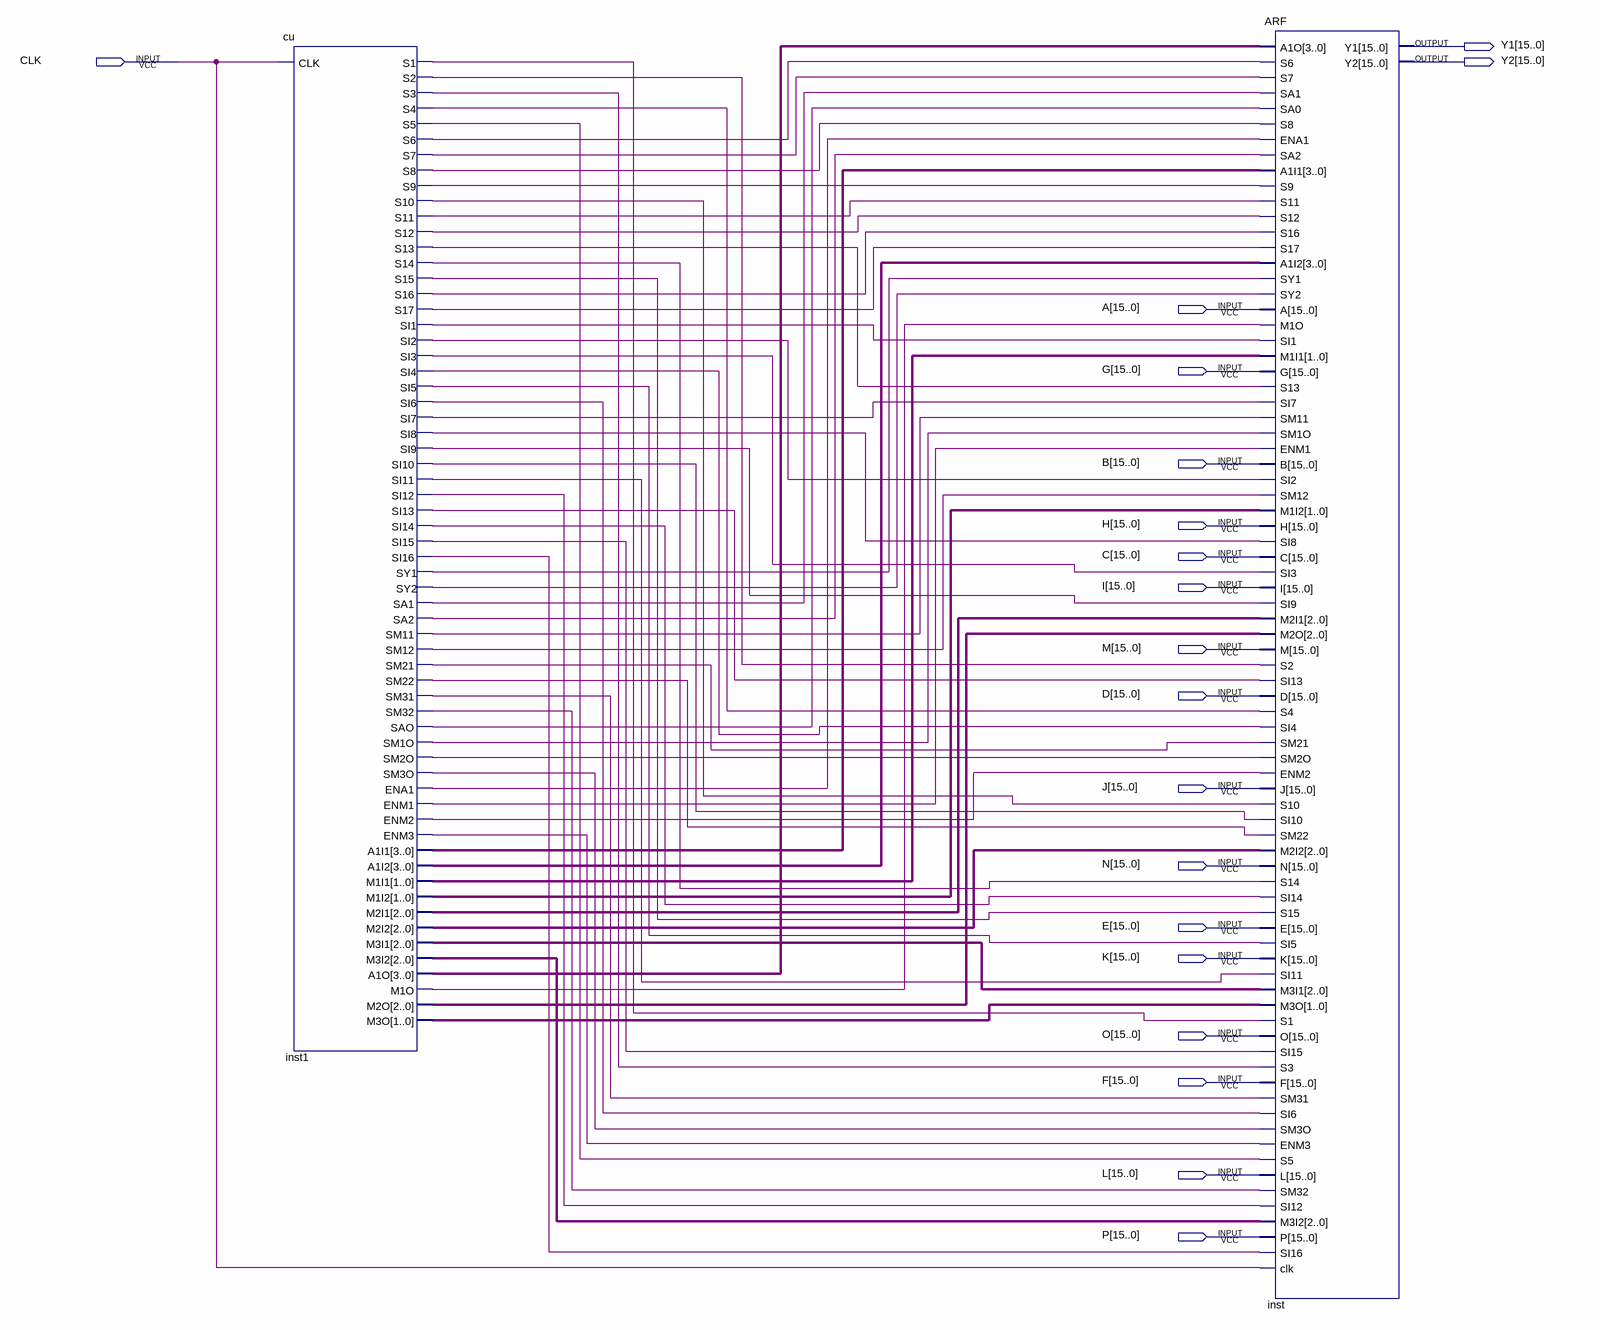
[diagram p0: schematic sheet]
// Quartus schematic Final.bdf as structural Verilog: 2 symbols, 19 pins
module Final (
  input  CLK,
  input  [15:0] A,
  input  [15:0] G,
  input  [15:0] B,
  input  [15:0] H,
  input  [15:0] C,
  input  [15:0] I,
  input  [15:0] M,
  input  [15:0] D,
  input  [15:0] J,
  input  [15:0] N,
  input  [15:0] E,
  input  [15:0] K,
  input  [15:0] O,
  input  [15:0] F,
  input  [15:0] L,
  input  [15:0] P,
  output [15:0] Y1,
  output [15:0] Y2
);

  wire inst1_ena1, inst1_enm1, inst1_enm2, inst1_enm3, inst1_m1o, inst1_s1, inst1_s2, inst1_s3, inst1_s4,
       inst1_s5, inst1_s6, inst1_s7, inst1_s8, inst1_s9, inst1_s10, inst1_s11, inst1_s12, inst1_s13,
       inst1_s14, inst1_s15, inst1_s16, inst1_s17, inst1_sa1, inst1_sa2, inst1_sao, inst1_si1, inst1_si2,
       inst1_si3, inst1_si4, inst1_si5, inst1_si6, inst1_si7, inst1_si8, inst1_si9, inst1_si10, inst1_si11,
       inst1_si12, inst1_si13, inst1_si14, inst1_si15, inst1_si16, inst1_sm1o, inst1_sm2o, inst1_sm3o,
       inst1_sm11, inst1_sm12, inst1_sm21, inst1_sm22, inst1_sm31, inst1_sm32, inst1_sy1, inst1_sy2;
  wire [1:0] inst1_m1i1, inst1_m1i2, inst1_m3o;
  wire [2:0] inst1_m2i1, inst1_m2i2, inst1_m2o, inst1_m3i1, inst1_m3i2;
  wire [3:0] inst1_a1i1, inst1_a1i2, inst1_a1o;

  cu inst1 (
    .CLK(CLK), .S1(inst1_s1), .S2(inst1_s2), .S3(inst1_s3), .S4(inst1_s4), .S5(inst1_s5), .S6(inst1_s6),
    .S7(inst1_s7), .S8(inst1_s8), .S9(inst1_s9), .S10(inst1_s10), .S11(inst1_s11), .S12(inst1_s12),
    .S13(inst1_s13), .S14(inst1_s14), .S15(inst1_s15), .S16(inst1_s16), .S17(inst1_s17), .SI1(inst1_si1),
    .SI2(inst1_si2), .SI3(inst1_si3), .SI4(inst1_si4), .SI5(inst1_si5), .SI6(inst1_si6), .SI7(inst1_si7),
    .SI8(inst1_si8), .SI9(inst1_si9), .SI10(inst1_si10), .SI11(inst1_si11), .SI12(inst1_si12),
    .SI13(inst1_si13), .SI14(inst1_si14), .SI15(inst1_si15), .SI16(inst1_si16), .SY1(inst1_sy1),
    .SY2(inst1_sy2), .SA1(inst1_sa1), .SA2(inst1_sa2), .SM11(inst1_sm11), .SM12(inst1_sm12),
    .SM21(inst1_sm21), .SM22(inst1_sm22), .SM31(inst1_sm31), .SM32(inst1_sm32), .SAO(inst1_sao),
    .SM1O(inst1_sm1o), .SM2O(inst1_sm2o), .SM3O(inst1_sm3o), .ENA1(inst1_ena1), .ENM1(inst1_enm1),
    .ENM2(inst1_enm2), .ENM3(inst1_enm3), .A1I1(inst1_a1i1), .A1I2(inst1_a1i2), .M1I1(inst1_m1i1),
    .M1I2(inst1_m1i2), .M2I1(inst1_m2i1), .M2I2(inst1_m2i2), .M3I1(inst1_m3i1), .M3I2(inst1_m3i2),
    .A1O(inst1_a1o), .M1O(inst1_m1o), .M2O(inst1_m2o), .M3O(inst1_m3o));
  ARF inst (
    .A1O(inst1_a1o), .S6(inst1_s6), .S7(inst1_s7), .SA1(inst1_sa1), .SA0(inst1_sao), .S8(inst1_s8),
    .ENA1(inst1_ena1), .SA2(inst1_sa2), .A1I1(inst1_a1i1), .S9(inst1_s9), .S11(inst1_s11), .S12(inst1_s12),
    .S16(inst1_s16), .S17(inst1_s17), .A1I2(inst1_a1i2), .SY1(inst1_sy1), .SY2(inst1_sy2), .A(A),
    .M1O(inst1_m1o), .SI1(inst1_si1), .M1I1(inst1_m1i1), .G(G), .S13(inst1_s13), .SI7(inst1_si7),
    .SM11(inst1_sm11), .SM1O(inst1_sm1o), .ENM1(inst1_enm1), .B(B), .SI2(inst1_si2), .SM12(inst1_sm12),
    .M1I2(inst1_m1i2), .H(H), .SI8(inst1_si8), .C(C), .SI3(inst1_si3), .I(I), .SI9(inst1_si9),
    .M2I1(inst1_m2i1), .M2O(inst1_m2o), .M(M), .S2(inst1_s2), .SI13(inst1_si13), .D(D), .S4(inst1_s4),
    .SI4(inst1_si4), .SM21(inst1_sm21), .SM2O(inst1_sm2o), .ENM2(inst1_enm2), .J(J), .S10(inst1_s10),
    .SI10(inst1_si10), .SM22(inst1_sm22), .M2I2(inst1_m2i2), .N(N), .S14(inst1_s14), .SI14(inst1_si14),
    .S15(inst1_s15), .E(E), .SI5(inst1_si5), .K(K), .SI11(inst1_si11), .M3I1(inst1_m3i1), .M3O(inst1_m3o),
    .S1(inst1_s1), .O(O), .SI15(inst1_si15), .S3(inst1_s3), .F(F), .SM31(inst1_sm31), .SI6(inst1_si6),
    .SM3O(inst1_sm3o), .ENM3(inst1_enm3), .S5(inst1_s5), .L(L), .SM32(inst1_sm32), .SI12(inst1_si12),
    .M3I2(inst1_m3i2), .P(P), .SI16(inst1_si16), .clk(CLK), .Y1(Y1), .Y2(Y2));
endmodule
